# Altium schematic sheet Atmega2560.SchDoc
size A4
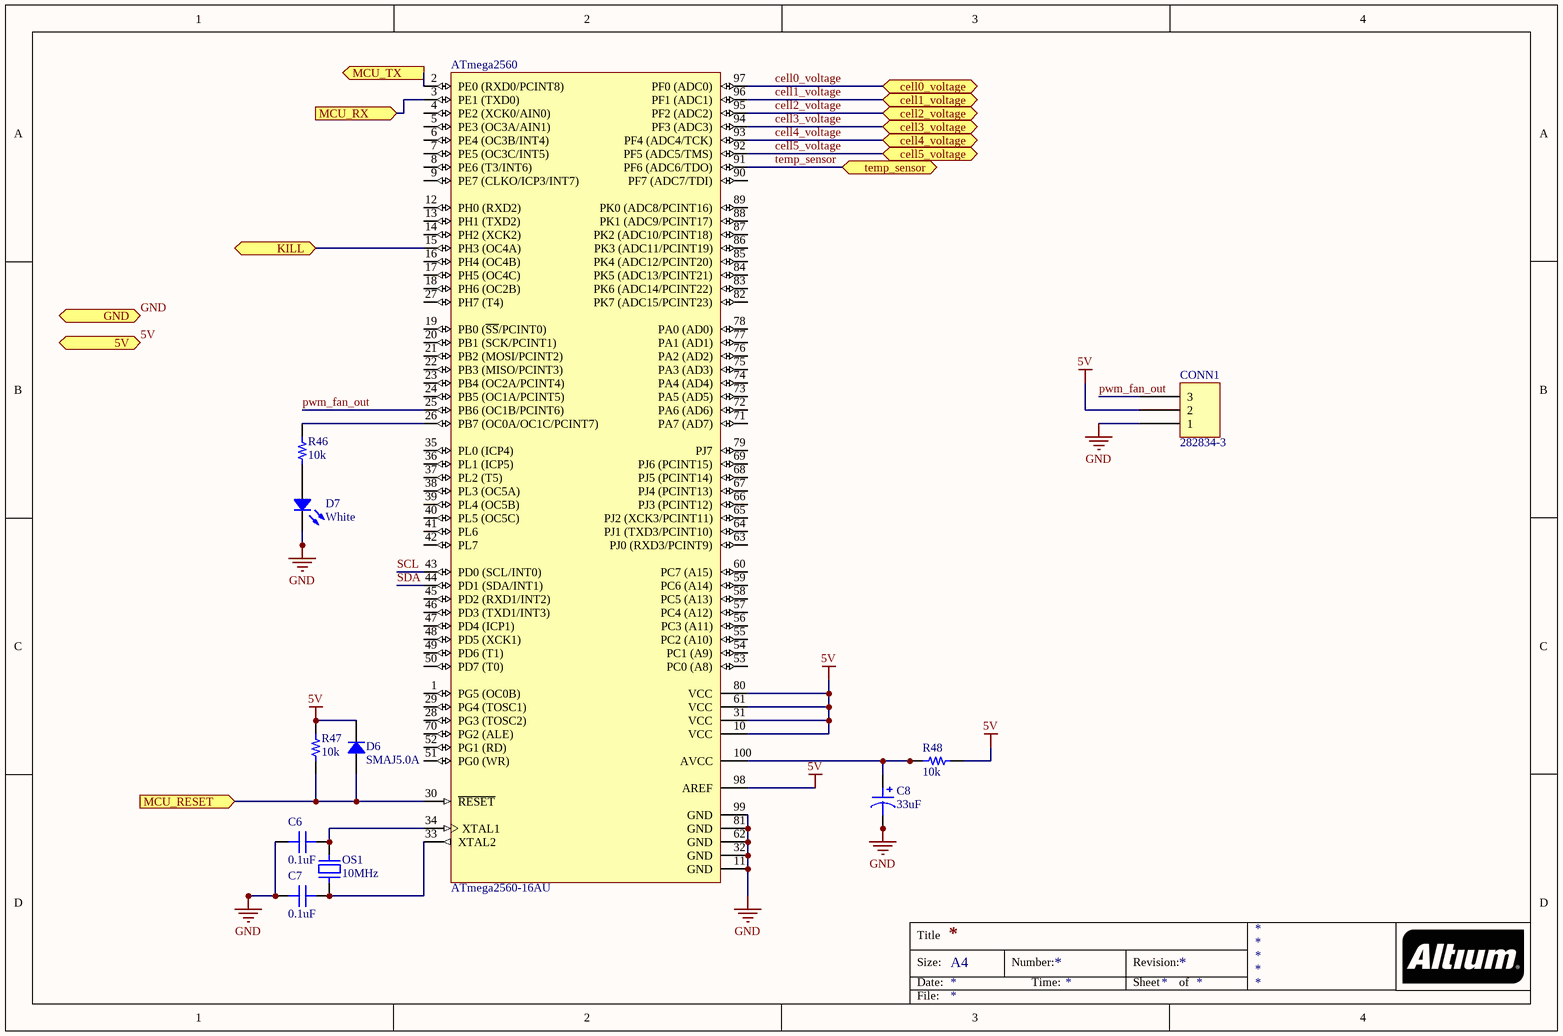
[diagram p0: Atmega2560.SchDoc]

## Parts
ATmega2560  ATmega2560-16AU  [100A_N]
C6  0.1uF  [CAP 0402/1005]
C7  0.1uF  [CAP 0402/1005]
C8  33uF  [CAP ALUM 6.6MM]
CONN1  282834-3  [TE 282834-3]
D6  SMAJ5.0A  [DO214AC SMA]
D7  White  [LED 0603/1608]
OS1  10MHz  [NDK NX5032GA]
R46  10k  [RES 0402/1005]
R47  10k  [RES 0402/1005]
R48  10k  [RES 0402/1005]

## Ports
5V, cell0_voltage (bidir), cell1_voltage (bidir), cell2_voltage (bidir), cell3_voltage (bidir), cell4_voltage (bidir), cell5_voltage (bidir), GND, KILL (bidir), MCU_RESET (in), MCU_RX (in), MCU_TX (out), temp_sensor (bidir)

## Nets
5V: ATmega2560.10(VCC) ATmega2560.31(VCC) ATmega2560.61(VCC) ATmega2560.80(VCC) ATmega2560.98(AREF) CONN1.2 D6.2 R47.2 R48.2 ; port 5V
GND: ATmega2560.11(GND) ATmega2560.32(GND) ATmega2560.62(GND) ATmega2560.81(GND) ATmega2560.99(GND) C6.2 C7.2 C8.2 CONN1.1 D7.2 ; port GND
cell0_voltage: ATmega2560.97(PF0_(ADC0)) ; port cell0_voltage
cell1_voltage: ATmega2560.96(PF1_(ADC1)) ; port cell1_voltage
cell2_voltage: ATmega2560.95(PF2_(ADC2)) ; port cell2_voltage
cell3_voltage: ATmega2560.94(PF3_(ADC3)) ; port cell3_voltage
cell4_voltage: ATmega2560.93(PF4_(ADC4/TCK)) ; port cell4_voltage
cell5_voltage: ATmega2560.92(PF5_(ADC5/TMS)) ; port cell5_voltage
KILL: ATmega2560.15(PH3_(OC4A)) ; port KILL
MCU_RESET: ATmega2560.30(~{RESET}) D6.1 R47.1 ; port MCU_RESET
MCU_RX: ATmega2560.3(PE1_(TXD0)) ; port MCU_RX
MCU_TX: ATmega2560.2(PE0_(RXD0/PCINT8)) ; port MCU_TX
pwm_fan_out: ATmega2560.25(PB6_(OC1B/PCINT6)) CONN1.3
SCL: ATmega2560.43(PD0_(SCL/INT0))
SDA: ATmega2560.44(PD1_(SDA/INT1))
temp_sensor: ATmega2560.91(PF6_(ADC6/TDO)) ; port temp_sensor
NetATmega2560_26: ATmega2560.26(PB7_(OC0A/OC1C/PCINT7)) R46.2
NetATmega2560_33: ATmega2560.33(XTAL2) C7.1 OS1.1
NetATmega2560_34: ATmega2560.34(XTAL1) C6.1 OS1.2
NetATmega2560_100: ATmega2560.100(AVCC) C8.1 R48.1
NetD7_1: D7.1 R46.1

Not connected (* = marked no-connect by the designer): ATmega2560 1(PG5_(OC0B)) 4(PE2_(XCK0/AIN0)) 5(PE3_(OC3A/AIN1)) 6(PE4_(OC3B/INT4)) 7(PE5_(OC3C/INT5)) 8(PE6_(T3/INT6)) 9(PE7_(CLKO/ICP3/INT7)) 12(PH0_(RXD2)) 13(PH1_(TXD2)) 14(PH2_(XCK2)) 16(PH4_(OC4B)) 17(PH5_(OC4C)) 18(PH6_(OC2B)) 19(PB0_(~{SS}/PCINT0)) 20(PB1_(SCK/PCINT1)) 21(PB2_(MOSI/PCINT2)) 22(PB3_(MISO/PCINT3)) 23(PB4_(OC2A/PCINT4)) 24(PB5_(OC1A/PCINT5)) 27(PH7_(T4)) 28(PG3_(TOSC2)) 29(PG4_(TOSC1)) 35(PL0_(ICP4)) 36(PL1_(ICP5)) 37(PL2_(T5)) 38(PL3_(OC5A)) 39(PL4_(OC5B)) 40(PL5_(OC5C)) 41(PL6) 42(PL7) 45(PD2_(RXD1/INT2)) 46(PD3_(TXD1/INT3)) 47(PD4_(ICP1)) 48(PD5_(XCK1)) 49(PD6_(T1)) 50(PD7_(T0)) 51(PG0_(WR)) 52(PG1_(RD)) 53(PC0_(A8)) 54(PC1_(A9)) 55(PC2_(A10)) 56(PC3_(A11)) 57(PC4_(A12)) 58(PC5_(A13)) 59(PC6_(A14)) 60(PC7_(A15)) 63(PJ0_(RXD3/PCINT9)) 64(PJ1_(TXD3/PCINT10)) 65(PJ2_(XCK3/PCINT11)) 66(PJ3_(PCINT12)) 67(PJ4_(PCINT13)) 68(PJ5_(PCINT14)) 69(PJ6_(PCINT15)) 70(PG2_(ALE)) 71(PA7_(AD7)) 72(PA6_(AD6)) 73(PA5_(AD5)) 74(PA4_(AD4)) 75(PA3_(AD3)) 76(PA2_(AD2)) 77(PA1_(AD1)) 78(PA0_(AD0)) 79(PJ7) 82(PK7_(ADC15/PCINT23)) 83(PK6_(ADC14/PCINT22)) 84(PK5_(ADC13/PCINT21)) 85(PK4_(ADC12/PCINT20)) 86(PK3_(ADC11/PCINT19)) 87(PK2_(ADC10/PCINT18)) 88(PK1_(ADC9/PCINT17)) 89(PK0_(ADC8/PCINT16)) 90(PF7_(ADC7/TDI))

## Notes on the sheet
- Title
- Size:
- Date:
- A4
- Number:
- Time:
- Revision:
- Sheet
- of
- File:

## Library data of the parts
ATmega2560 = ATmega2560-16AU: 8-bit AVR Microcontroller, 4.5-5.5V, 256KB Flash, 4KB EEPROM, 8KB SRAM, 86 GPIO pins, 100-pin TQFP, Industrial Grade (-40°C to 85°C), Pb-Free; Published: 1-Apr-2010; DatasheetVersion: revL, Aug-2007; PackageVersion: revC, Oct-2001; PackageReference: 100A; Publisher: Altium Limited; PackageDescription: 100-Pin Thin Profile Plastic Quad Flat Pack (TQFP), 14 x 14 x 1.0 mm Body, 0.5 mm Pitch; Supplier 1: Digi-Key; Supplier Part Number 1: ATMEGA2560-16AU-ND; Supplier 2: Farnell; Supplier Part Number 2: 1288330; Supplier 3: Farnell; Supplier Part Number 3: 1661740; Supplier 4: Mouser; Supplier Part Number 4: 556-ATMEGA2560-16AU; Code_JEDEC: MS-026-AED; ComponentLink1Description: Manufacturer Link; ComponentLink1URL: http://www.atmel.com/products/avr/default.asp?; ComponentLink2Description: ATmega640/1280/1281/2560/2561 Datasheet; ComponentLink2URL: http://www.atmel.com/dyn/resources/prod_documents/doc2549.pdf; ComponentLink3Description: ATmega640/1280/1281/2560/2561 Summary; ComponentLink3URL: http://www.atmel.com/dyn/resources/prod_documents/2549S.pdf; ComponentLink4Description: Atmel.com Home; ComponentLink4URL: http://www.atmel.com
C6 C7 = C1005X7R1C104K050BC: CAP CER 0.1UF 16V X7R 0402; Manufacturer: TDK Corporation; TemperatureRange: -55C ~ 125C; Tolerance: 10%; Value: 0.1uF; Part Number: C1005X7R1C104K050BC; PartId: 3856; Supplier 1: Digi-Key; Supplier Part Number 1: 445-4952-2-ND; ComponentLink1Description: Datasheet; ComponentLink1URL: https://product.tdk.com/info/en/catalog/datasheets/mlcc_commercial_general_en.pdf; ComponentLink2Description: Digi-Key listing; ComponentLink2URL: http://digikey.com/product-detail/en/C1005X7R1C104K050BC/445-4952-2-ND/2093220; TemperatureCoefficient: X7R; Voltage: 16V; Price: 0.0066; Type: -; Device Package: 0402 (1005 Metric)
C8 = UWX1C330MCL1GB: CAP ALUM 33UF 20% 16V SMD; Manufacturer: Nichicon; TemperatureRange: -40C ~ 85C; Type: General Purpose; Ripple Current: 49mA; Lifetime @ Temp: 2000 Hrs @ 85C; Value: 33uF; Part Number: UWX1C330MCL1GB; PartId: 7190; Supplier 1: Digi-Key; Supplier Part Number 1: 493-2102-2-ND; ComponentLink1Description: Datasheet; ComponentLink1URL: http://nichicon-us.com/english/products/pdfs/e-wx.pdf; ComponentLink2Description: Digi-Key listing; ComponentLink2URL: http://digikey.com/product-detail/en/UWX1C330MCL1GB/493-2102-2-ND/589843; Tolerance: 20%; Voltage: 16V; Price: 0.0916; Device Package: Radial, Can - SMD; Impedance: -
CONN1 = 282834-3: TERM BLOCK 3POS SIDE ENT 2.54MM; Manufacturer: TE Connectivity AMP Connectors; TemperatureRange: -40C ~ 105C; Voltage: 150V; Pitch: 0.100" (2.54mm); Number Of Levels: 1; Positions Per Level: 3; Part Number: 282834-3; PartId: 9290; Supplier 1: Digi-Key; Supplier Part Number 1: A98334-ND; ComponentLink1Description: Datasheet; ComponentLink1URL: http://www.te.com/commerce/DocumentDelivery/DDEController?Action=srchrtrv&DocNm=282834&DocType=Customer+Drawing&DocLang=English; ComponentLink2Description: Digi-Key Listing; ComponentLink2URL: http://www.digikey.ca/product-detail/en/282834-3/A98334-ND/1153264; Price: 2.25; Colour: Green; Orientation: Horizontal with Board
D6 = SMAJ5.0A: TVS DIODE 5VWM 9.2VC SMA; Manufacturer: Littelfuse Inc.; Type: Surface Mount; Power - Peak Pulse: 400W; Current - Peak Pulse: 43.5A; Voltage (Clamping): 9.2V; Voltage (Breakdown): 6.4V; Voltage (Reverse Standoff): 5V; Part Number: SMAJ5.0A; PartId: 7757; Supplier 1: Digi-Key; Supplier Part Number 1: SMAJ5.0ALFTR-ND; ComponentLink1Description: Datasheet; ComponentLink1URL: http://www.littelfuse.com/~/media/electronics/datasheets/tvs_diodes/littelfuse_tvs_diode_smaj_datasheet.pdf.pdf; ComponentLink2Description: Digi-Key Listing; ComponentLink2URL: http://www.digikey.ca/product-detail/en/SMAJ5.0A/SMAJ5.0ALFTR-ND/762250; Operating Temperature: -55C ~ 150C (TJ); Price: 0.1626; Device Package: DO-214AC, SMA
D7 = LTW-C191TS5: LED WHITE 0603 SMD; Manufacturer: Lite-On Inc.; Value: Green; Type: Surface Mount; Millicandela: 112.5mcd; Voltage Forward: 2.93V; Current (Test): 5mA; Viewing Angle: 130; Part Number: LTW-C191TS5; PartId: 7055; Supplier 1: Digi-Key; Supplier Part Number 1: 160-1724-2-ND; ComponentLink1Description: Datasheet; ComponentLink1URL: http://optoelectronics.liteon.com/upload/download/DS22-2004-201/S_110_LTW-C191TS5.pdf; ComponentLink2Description: Digi-Key Listing; ComponentLink2URL: http://www.digikey.ca/product-detail/en/LTW-C191TS5/160-1724-2-ND/726332; Price: 0.1966; Device Package: 0603 (1608 Metric); Colour: White; Lens Transparency: -
OS1 = NX5032GA-10.000M-STD-CSU-1: CRYSTAL 10.0000MHZ 8PF SMD; Manufacturer: NDK; Frequency Stability: 150ppm; Frequency Tolerance: 50ppm; ESR: 150 Ohm; Operating Mode: Fundamental; Part Number: NX5032GA-10.000M-STD-CSU-1; PartId: 8474; Supplier 1: Digi-Key; Supplier Part Number 1: 644-1133-2-ND; ComponentLink1Description: Datasheet; ComponentLink1URL: http://www.ndk.com/images/products/catalog/c_NX5032GA-STD-CSU-2_e.pdf; ComponentLink2Description: Digi-Key Listing; ComponentLink2URL: http://www.digikey.com/product-detail/en/NX5032GA-10.000M-STD-CSU-1/644-1133-2-ND/1788473; Price: 0.63; Type: MHz Crystal; Device Package: 2-SMD; Frequency: 10MHz; Load Capacitance: 8pF
R46-R48 = ERJ-2RKF1002X: RES SMD 10K OHM 1% 1/10W 0402; Manufacturer: Panasonic Electronic Components; TemperatureRange: -55C ~ 155C; TemperatureCoefficient: 100ppm/C; PowerRating: 0.1W, 1/10W; Value: 10k; Part Number: ERJ-2RKF1002X; PartId: 1; Supplier 1: Digi-Key; Supplier Part Number 1: P10.0KLTR-ND; ComponentLink1Description: Datasheet; ComponentLink1URL: http://industrial.panasonic.com/www-cgi/jvcr13pz.cgi?E+PZ+3+AOA0002+ERJ2RKF1002X+7+WW; ComponentLink2Description: Digikey listing; ComponentLink2URL: http://digikey.com/product-detail/en/ERJ-2RKF1002X/P10.0KLTR-ND/192073; Tolerance: 1%; Price: 0.0043; Type: Thick Film; Device Package: 0402 (1005 Metric)